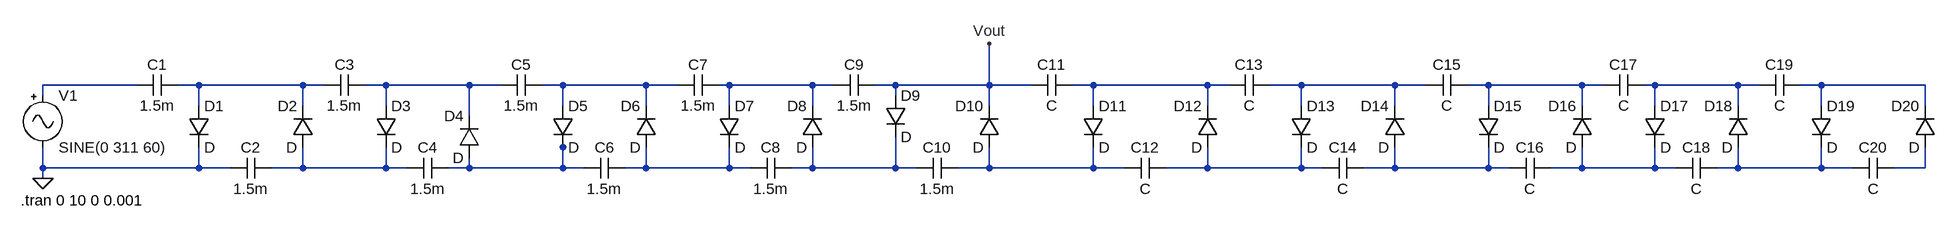
[diagram p0: schematic Simulation.asc]
Simulation.asc, the LTspice schematic file:
Version 4
SHEET 1 2692 680
WIRE -80 -64 -224 -64
WIRE 16 -64 -16 -64
WIRE 176 -64 16 -64
WIRE 208 -64 176 -64
WIRE 304 -64 272 -64
WIRE 432 -64 304 -64
WIRE 480 -64 432 -64
WIRE 576 -64 544 -64
WIRE 704 -64 576 -64
WIRE 752 -64 704 -64
WIRE 832 -64 816 -64
WIRE 960 -64 832 -64
WIRE 992 -64 960 -64
WIRE 1088 -64 1056 -64
WIRE 1232 -64 1232 -128
WIRE 1232 -64 1088 -64
WIRE 1296 -64 1232 -64
WIRE 1392 -64 1360 -64
WIRE 1568 -64 1392 -64
WIRE 1600 -64 1568 -64
WIRE 1712 -64 1664 -64
WIRE 1856 -64 1712 -64
WIRE 1904 -64 1856 -64
WIRE 2000 -64 1968 -64
WIRE 2144 -64 2000 -64
WIRE 2176 -64 2144 -64
WIRE 2256 -64 2240 -64
WIRE 2384 -64 2256 -64
WIRE 2416 -64 2384 -64
WIRE 2512 -64 2480 -64
WIRE 2672 -64 2512 -64
WIRE -224 -48 -224 -64
WIRE 1088 -48 1088 -64
WIRE 16 -32 16 -64
WIRE 176 -32 176 -64
WIRE 304 -32 304 -64
WIRE 576 -32 576 -64
WIRE 704 -32 704 -64
WIRE 832 -32 832 -64
WIRE 960 -32 960 -64
WIRE 1232 -32 1232 -64
WIRE 1392 -32 1392 -64
WIRE 1568 -32 1568 -64
WIRE 1712 -32 1712 -64
WIRE 1856 -32 1856 -64
WIRE 2000 -32 2000 -64
WIRE 2144 -32 2144 -64
WIRE 2256 -32 2256 -64
WIRE 2384 -32 2384 -64
WIRE 2512 -32 2512 -64
WIRE 2672 -32 2672 -64
WIRE 432 -16 432 -64
WIRE 576 32 576 16
WIRE -224 64 -224 32
WIRE 16 64 16 32
WIRE 16 64 -224 64
WIRE 64 64 16 64
WIRE 176 64 176 32
WIRE 176 64 128 64
WIRE 304 64 304 32
WIRE 304 64 176 64
WIRE 336 64 304 64
WIRE 432 64 432 48
WIRE 432 64 400 64
WIRE 576 64 576 32
WIRE 576 64 432 64
WIRE 608 64 576 64
WIRE 704 64 704 32
WIRE 704 64 672 64
WIRE 832 64 832 32
WIRE 832 64 704 64
WIRE 864 64 832 64
WIRE 960 64 960 32
WIRE 960 64 928 64
WIRE 1088 64 1088 16
WIRE 1088 64 960 64
WIRE 1120 64 1088 64
WIRE 1232 64 1232 32
WIRE 1232 64 1184 64
WIRE 1392 64 1392 32
WIRE 1392 64 1232 64
WIRE 1440 64 1392 64
WIRE 1568 64 1568 32
WIRE 1568 64 1504 64
WIRE 1712 64 1712 32
WIRE 1712 64 1568 64
WIRE 1744 64 1712 64
WIRE 1856 64 1856 32
WIRE 1856 64 1808 64
WIRE 2000 64 2000 32
WIRE 2000 64 1856 64
WIRE 2032 64 2000 64
WIRE 2144 64 2144 32
WIRE 2144 64 2096 64
WIRE 2256 64 2256 32
WIRE 2256 64 2144 64
WIRE 2288 64 2256 64
WIRE 2384 64 2384 32
WIRE 2384 64 2352 64
WIRE 2512 64 2512 32
WIRE 2512 64 2384 64
WIRE 2560 64 2512 64
WIRE 2672 64 2672 32
WIRE 2672 64 2624 64
WIRE -224 80 -224 64
FLAG 1232 -128 Vout
FLAG -224 80 0
SYMBOL cap -16 -80 R90
WINDOW 0 0 32 VBottom 2
WINDOW 3 32 32 VTop 2
SYMATTR InstName C1
SYMATTR Value 1.5m
SYMBOL diode 0 -32 R0
SYMATTR InstName D1
SYMBOL diode 192 32 R180
WINDOW 0 24 64 Left 2
WINDOW 3 24 0 Left 2
SYMATTR InstName D2
SYMBOL cap 128 48 R90
WINDOW 0 0 32 VBottom 2
WINDOW 3 32 32 VTop 2
SYMATTR InstName C2
SYMATTR Value 1.5m
SYMBOL Misc\\signal -224 -64 R0
WINDOW 123 0 0 Left 0
WINDOW 39 0 0 Left 0
SYMATTR InstName V1
SYMATTR Value SINE(0 311 60)
SYMBOL cap 272 -80 R90
WINDOW 0 0 32 VBottom 2
WINDOW 3 32 32 VTop 2
SYMATTR InstName C3
SYMATTR Value 1.5m
SYMBOL cap 400 48 R90
WINDOW 0 0 32 VBottom 2
WINDOW 3 32 32 VTop 2
SYMATTR InstName C4
SYMATTR Value 1.5m
SYMBOL diode 288 -32 R0
SYMATTR InstName D3
SYMBOL diode 448 48 R180
WINDOW 0 24 64 Left 2
WINDOW 3 24 0 Left 2
SYMATTR InstName D4
SYMBOL cap 544 -80 R90
WINDOW 0 0 32 VBottom 2
WINDOW 3 32 32 VTop 2
SYMATTR InstName C5
SYMATTR Value 1.5m
SYMBOL cap 672 48 R90
WINDOW 0 0 32 VBottom 2
WINDOW 3 32 32 VTop 2
SYMATTR InstName C6
SYMATTR Value 1.5m
SYMBOL cap 816 -80 R90
WINDOW 0 0 32 VBottom 2
WINDOW 3 32 32 VTop 2
SYMATTR InstName C7
SYMATTR Value 1.5m
SYMBOL cap 928 48 R90
WINDOW 0 0 32 VBottom 2
WINDOW 3 32 32 VTop 2
SYMATTR InstName C8
SYMATTR Value 1.5m
SYMBOL cap 1056 -80 R90
WINDOW 0 0 32 VBottom 2
WINDOW 3 32 32 VTop 2
SYMATTR InstName C9
SYMATTR Value 1.5m
SYMBOL cap 1184 48 R90
WINDOW 0 0 32 VBottom 2
WINDOW 3 32 32 VTop 2
SYMATTR InstName C10
SYMATTR Value 1.5m
SYMBOL diode 560 -32 R0
SYMATTR InstName D5
SYMBOL diode 816 -32 R0
SYMATTR InstName D7
SYMBOL diode 1072 -48 R0
SYMATTR InstName D9
SYMBOL diode 720 32 R180
WINDOW 0 24 64 Left 2
WINDOW 3 24 0 Left 2
SYMATTR InstName D6
SYMBOL diode 976 32 R180
WINDOW 0 24 64 Left 2
WINDOW 3 24 0 Left 2
SYMATTR InstName D8
SYMBOL diode 1248 32 R180
WINDOW 0 24 64 Left 2
WINDOW 3 24 0 Left 2
SYMATTR InstName D10
SYMBOL cap 1360 -80 R90
WINDOW 0 0 32 VBottom 2
WINDOW 3 32 32 VTop 2
SYMATTR InstName C11
SYMBOL cap 1504 48 R90
WINDOW 0 0 32 VBottom 2
WINDOW 3 32 32 VTop 2
SYMATTR InstName C12
SYMBOL cap 1664 -80 R90
WINDOW 0 0 32 VBottom 2
WINDOW 3 32 32 VTop 2
SYMATTR InstName C13
SYMBOL cap 1808 48 R90
WINDOW 0 0 32 VBottom 2
WINDOW 3 32 32 VTop 2
SYMATTR InstName C14
SYMBOL cap 1968 -80 R90
WINDOW 0 0 32 VBottom 2
WINDOW 3 32 32 VTop 2
SYMATTR InstName C15
SYMBOL cap 2096 48 R90
WINDOW 0 0 32 VBottom 2
WINDOW 3 32 32 VTop 2
SYMATTR InstName C16
SYMBOL cap 2240 -80 R90
WINDOW 0 0 32 VBottom 2
WINDOW 3 32 32 VTop 2
SYMATTR InstName C17
SYMBOL cap 2352 48 R90
WINDOW 0 0 32 VBottom 2
WINDOW 3 32 32 VTop 2
SYMATTR InstName C18
SYMBOL cap 2480 -80 R90
WINDOW 0 0 32 VBottom 2
WINDOW 3 32 32 VTop 2
SYMATTR InstName C19
SYMBOL cap 2624 48 R90
WINDOW 0 0 32 VBottom 2
WINDOW 3 32 32 VTop 2
SYMATTR InstName C20
SYMBOL diode 1376 -32 R0
SYMATTR InstName D11
SYMBOL diode 1584 32 R180
WINDOW 0 24 64 Left 2
WINDOW 3 24 0 Left 2
SYMATTR InstName D12
SYMBOL diode 1696 -32 R0
SYMATTR InstName D13
SYMBOL diode 1872 32 R180
WINDOW 0 24 64 Left 2
WINDOW 3 24 0 Left 2
SYMATTR InstName D14
SYMBOL diode 1984 -32 R0
SYMATTR InstName D15
SYMBOL diode 2160 32 R180
WINDOW 0 24 64 Left 2
WINDOW 3 24 0 Left 2
SYMATTR InstName D16
SYMBOL diode 2240 -32 R0
SYMATTR InstName D17
SYMBOL diode 2400 32 R180
WINDOW 0 24 64 Left 2
WINDOW 3 24 0 Left 2
SYMATTR InstName D18
SYMBOL diode 2496 -32 R0
SYMATTR InstName D19
SYMBOL diode 2688 32 R180
WINDOW 0 24 64 Left 2
WINDOW 3 24 0 Left 2
SYMATTR InstName D20
TEXT -258 114 Left 2 !.tran 0 10 0 0.001

The netlist it stands for:
* Simulation.asc
C1 N002 N001 1.5m
D1 N002 0 D
D2 N012 N002 D
C2 N012 0 1.5m
V1 N001 0 SINE(0 311 60)
C3 N003 N002 1.5m
C4 N011 N012 1.5m
D3 N003 N012 D
D4 N011 N003 D
C5 N004 N003 1.5m
C6 N013 N011 1.5m
C7 N005 N004 1.5m
C8 N014 N013 1.5m
C9 Vout N005 1.5m
C10 N015 N014 1.5m
D5 N004 N011 D
D7 N005 N013 D
D9 Vout N014 D
D6 N013 N004 D
D8 N014 N005 D
D10 N015 Vout D
C11 N006 Vout C
C12 N016 N015 C
C13 N007 N006 C
C14 N017 N016 C
C15 N008 N007 C
C16 N018 N017 C
C17 N009 N008 C
C18 N019 N018 C
C19 N010 N009 C
C20 N020 N019 C
D11 N006 N015 D
D12 N016 N006 D
D13 N007 N016 D
D14 N017 N007 D
D15 N008 N017 D
D16 N018 N008 D
D17 N009 N018 D
D18 N019 N009 D
D19 N010 N019 D
D20 N020 N010 D
.model D D
.lib standard.dio
.tran 0 10 0 0.001
.backanno
.end